# Altium schematic sheet 盟科大讯飞.schdoc
size B
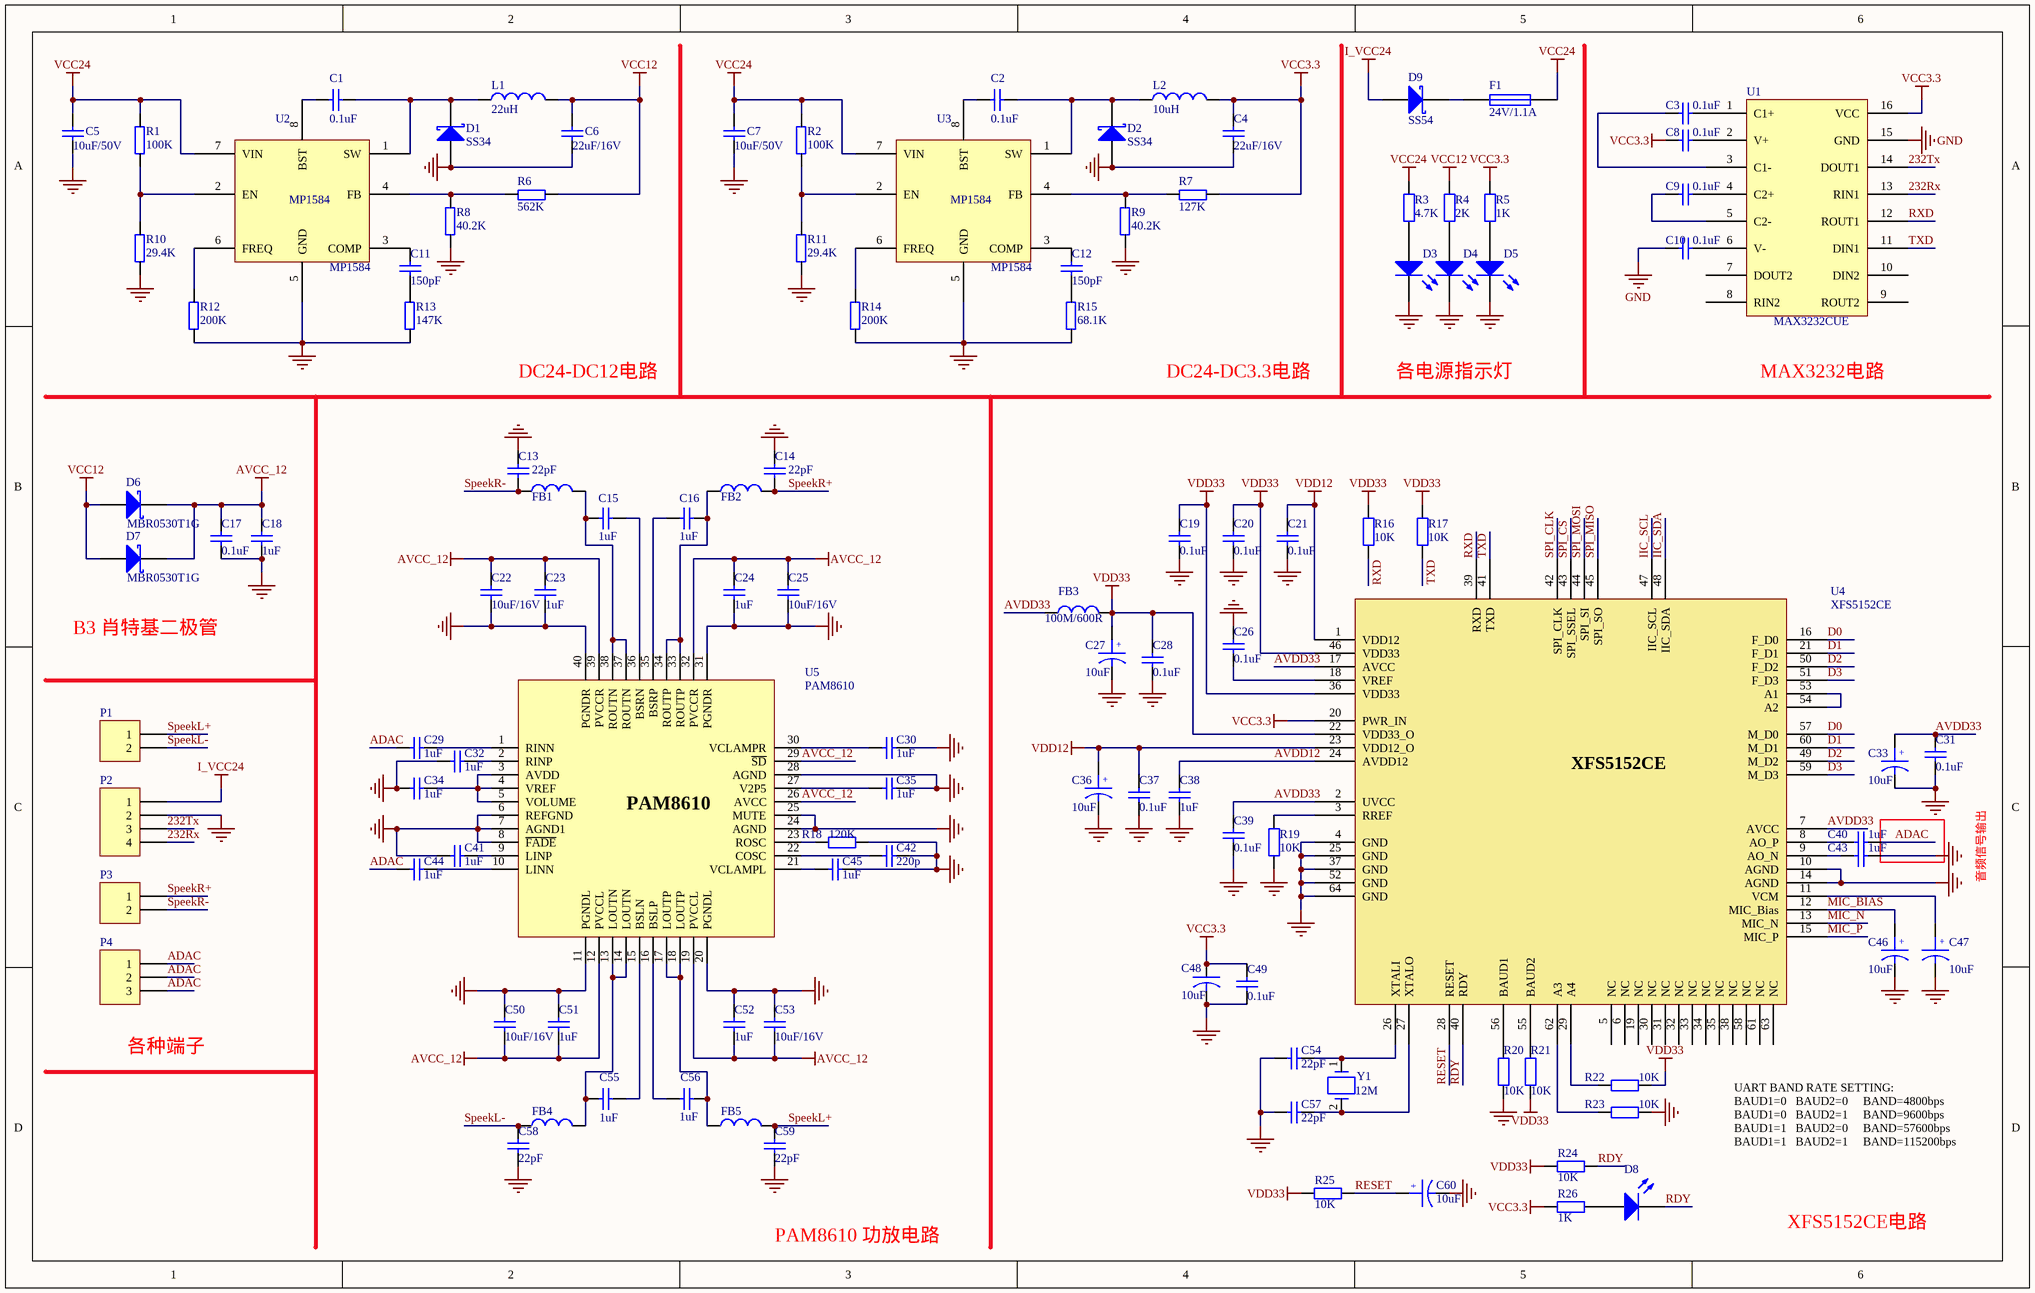
[diagram p0: 盟科大讯飞.schdoc]

## Parts
C1  0.1uF  [LC-0603_C]
C2  0.1uF  [LC-0603_C]
C3  0.1uF  [LC-0603_C]
C4  22uF/16V  [LC-1206_C]
C5  10uF/50V  [LC-1206_C]
C6  22uF/16V  [LC-1206_C]
C7  10uF/50V  [LC-1206_C]
C8  0.1uF  [LC-0603_C]
C9  0.1uF  [LC-0603_C]
C10  0.1uF  [LC-0603_C]
C11  150pF  [LC-0603_C]
C12  150pF  [LC-0603_C]
C13  22pF  [LC-0603_C]
C14  22pF  [LC-0603_C]
C15  1uF  [LC-0603_C]
C16  1uF  [LC-0603_C]
C17  0.1uF  [LC-0603_C]
C18  1uF  [LC-0603_C]
C19  0.1uF  [LC-0603_C]
C20  0.1uF  [LC-0603_C]
C21  0.1uF  [LC-0603_C]
C22  10uF/16V  [LC-1206_C]
C23  1uF  [LC-0603_C]
C24  1uF  [LC-0603_C]
C25  10uF/16V  [LC-1206_C]
C26  0.1uF  [LC-0603_C]
C27  10uF  [LC-CASE-A_3216]
C28  0.1uF  [LC-0603_C]
C29  1uF  [LC-0603_C]
C30  1uF  [LC-0603_C]
C31  0.1uF  [LC-0603_C]
C32  1uF  [LC-0603_C]
C33  10uF  [LC-CASE-A_3216]
C34  1uF  [LC-0603_C]
C35  1uF  [LC-0603_C]
C36  10uF  [LC-CASE-A_3216]
C37  0.1uF  [LC-0603_C]
C38  1uF  [LC-0603_C]
C39  0.1uF  [LC-0603_C]
C40  1uF  [LC-0603_C]
C41  1uF  [LC-0603_C]
C42  220p  [LC-0603_C]
C43  1uF  [LC-0603_C]
C44  1uF  [LC-0603_C]
C45  1uF  [LC-0603_C]
C46  10uF  [LC-CASE-A_3216]
C47  10uF  [LC-CASE-A_3216]
C48  10uF  [LC-CASE-A_3216]
C49  0.1uF  [LC-0603_C]
C50  10uF/16V  [LC-1206_C]
C51  1uF  [LC-0603_C]
C52  1uF  [LC-0603_C]
C53  10uF/16V  [LC-1206_C]
C54  22pF  [LC-0603_C]
C55  1uF  [LC-0603_C]
C56  1uF  [LC-0603_C]
C57  22pF  [LC-0603_C]
C58  22pF  [LC-0603_C]
C59  22pF  [LC-0603_C]
C60  10uF  [LC-CASE-A_3216]
D1  SS34  [SS34]
D2  SS34  [SS34]
D3  LED  [LC-0805_LED_S1]  (value not drawn)
D4  LED  [LC-0805_LED_S1]  (value not drawn)
D5  LED  [LC-0805_LED_S1]  (value not drawn)
D6  MBR0530T1G  [B3肖特基二极管]
D7  MBR0530T1G  [B3肖特基二极管]
D8  LED  [LC-0805_LED_S1]  (value not drawn)
D9  SS54  [DIOM6959X26N]
F1  24V/1.1A  [1206 F]
FB1  100M/600R  [LC-0805_L]  (value not drawn)
FB2  100M/600R  [LC-0805_L]  (value not drawn)
FB3  100M/600R  [LC-0805_L]
FB4  100M/600R  [LC-0805_L]  (value not drawn)
FB5  100M/600R  [LC-0805_L]  (value not drawn)
L1  22uH  [7*7*4mm电感]
L2  10uH  [7*7*4mm电感]
P1  (no value)  [DZ-2-3.5mm]
P2  (no value)  [DZ-4-3.5mm]
P3  (no value)  [DZ-2-3.5mm]
P4  (no value)  [单刀双掷贴片开关]
R1  100K  [LC-0603_R]
R2  100K  [LC-0603_R]
R3  4.7K  [LC-0603_R]
R4  2K  [LC-0603_R]
R5  1K  [LC-0603_R]
R6  562K  [LC-0603_R]
R7  127K  [LC-0603_R]
R8  40.2K  [LC-0603_R]
R9  40.2K  [LC-0603_R]
R10  29.4K  [LC-0603_R]
R11  29.4K  [LC-0603_R]
R12  200K  [LC-0603_R]
R13  147K  [LC-0603_R]
R14  200K  [LC-0603_R]
R15  68.1K  [LC-0603_R]
R16  10K  [LC-0603_R]
R17  10K  [LC-0603_R]
R18  120K  [LC-0603_R]
R19  10K  [LC-0603_R]
R20  10K  [LC-0603_R]
R21  10K  [LC-0603_R]
R22  10K  [LC-0603_R]
R23  10K  [LC-0603_R]
R24  10K  [LC-0603_R]
R25  10K  [LC-0603_R]
R26  1K  [LC-0603_R]
U1  MAX3232CUE  [LC-SOIC-16_150mil]
U2  MP1584  [LC-SOIC-8_EP_150mil]
U3  MP1584  [LC-SOIC-8_EP_150mil]
U4  XFS5152CE  [LQFP64 10*10]
U5  PAM8610  [QFN50P600X600X80-40N]
Y1  12M  [XTAL 晶振]

## Nets
AVCC_12: C17.1 C18.1 C22.1 C23.1 C24.1 C25.1 C50.1 C51.1 C52.1 C53.1 D6.1(K) D7.1(K) U5.12(PVCCL) U5.19(PVCCL) U5.26(AVCC) U5.29(~{SD}) U5.32(PVCCR) U5.39(PVCCR)
GND: C4.1 C5.2 C6.1 C7.2 C10.2 C13.1 C14.1 C17.2 C18.2 C19.2 C20.2 C21.2 C22.2 C23.2 C24.2 C25.2 C26.1 C27.2 C28.2 C30.2 C31.2 C32.1 C33.2 C34.1 C35.2 C36.2 C37.2 C38.1 C39.2 C41.1 C42.2 C43.1 C45.2 C46.2 C47.2 C48.2 C49.2 C50.2 C51.2 C52.2 C53.2 C54.1 C57.1 C58.1 C59.1 C60.2 D1.2(A) D2.2(A) D3.2(K) D4.2(K) D5.2(K) P2.2 R8.2 R9.2 R10.2 R11.2 R12.2 R13.2 R14.2 R15.2 R18.1 R19.1 R20.2 R23.1 U1.15(GND) U2.5(GND) U3.5(GND) U4.4(GND) U4.10(AGND) U4.14(AGND) U4.25(GND) U4.37(GND) U4.52(GND) U4.64(GND) U5.6(REFGND) U5.7(AGND1) U5.8(~{FADE}) U5.11(PGNDL) U5.20(PGNDL) U5.24(AGND) U5.25(MUTE) U5.28(AGND) U5.31(PGNDR) U5.40(PGNDR)
I_VCC24: D9.2(A) P2.1
VCC3.3: C4.2 C8.2 C48.1 C49.1 L2.2 R5.1 R7.2 R26.1 U1.16(VCC) U4.20(PWR_IN)
VCC12: C6.2 D6.2(A) D7.2(A) L1.2 R4.2 R6.2
VCC24: C5.1 C7.1 F1.2 R1.1 R2.1 R3.1 U2.7(VIN) U3.7(VIN)
VDD12: C21.1 C36.1 C37.1 U4.1(VDD12) U4.23(VDD12_O)
VDD33: C19.1 C20.1 C27.1 C28.1 FB3.2 R16.2 R17.1 R21.2 R22.2 R24.1 R25.1 U4.22(VDD33_O) U4.36(VDD33) U4.46(VDD33)
232Rx: P2.4 U1.13(RIN1)
232Tx: P2.3 U1.14(DOUT1)
ADAC: C29.1 C40.1 C44.1 P4.1 P4.2 P4.3
AVDD12: C38.2 U4.24(AVDD12)
AVDD33: C31.1 C33.1 C39.1 FB3.1 U4.2(UVCC) U4.7(AVCC) U4.17(AVCC)
D0: U4.16(F_D0) U4.57(M_D0)
D1: U4.21(F_D1) U4.60(M_D1)
D2: U4.49(M_D2) U4.50(F_D2)
D3: U4.51(F_D3) U4.59(M_D3)
IIC_SCL: U4.47(IIC_SCL)
IIC_SDA: U4.48(IIC_SDA)
MIC_BIAS: C46.1 U4.12(MIC_Bias)
MIC_N: U4.13(MIC_N)
MIC_P: U4.15(MIC_P)
RDY: D8.2(K) R24.2 U4.40(RDY)
RESET: C60.1 R25.2 U4.28(RESET)
RXD: R16.1 U1.12(ROUT1) U4.39(RXD)
SpeekL+: C59.2 FB5.2 P1.1
SpeekL-: C58.2 FB4.1 P1.2
SpeekR+: C14.2 FB2.2 P3.1
SpeekR-: C13.2 FB1.1 P3.2
SPI_CLK: U4.42(SPI_CLK)
SPI_CS: U4.43(SPI_SSEL)
SPI_MISO: U4.45(SPI_SO)
SPI_MOSI: U4.44(SPI_SI)
TXD: R17.2 U1.11(DIN1) U4.41(TXD)
NetC1_1: C1.1 D1.1(K) L1.1 U2.1(SW)
NetC1_2: C1.2 U2.8(BST)
NetC2_1: C2.1 D2.1(K) L2.1 U3.1(SW)
NetC2_2: C2.2 U3.8(BST)
NetC3_1: C3.1 U1.1(C1+)
NetC3_2: C3.2 U1.3(C1-)
NetC8_1: C8.1 U1.2(V+)
NetC9_1: C9.1 U1.4(C2+)
NetC9_2: C9.2 U1.5(C2-)
NetC10_1: C10.1 U1.6(V-)
NetC11_1: C11.1 R13.1
NetC11_2: C11.2 U2.3(COMP)
NetC12_1: C12.1 R15.1
NetC12_2: C12.2 U3.3(COMP)
NetC15_1: C15.1 FB1.2 U5.37(ROUTN) U5.38(ROUTN)
NetC15_2: C15.2 U5.36(BSRN)
NetC16_1: C16.1 U5.35(BSRP)
NetC16_2: C16.2 FB2.1 U5.33(ROUTP) U5.34(ROUTP)
NetC26_2: C26.2 U4.18(VREF)
NetC29_2: C29.2 U5.1(RINN)
NetC30_1: C30.1 U5.30(VCLAMPR)
NetC32_2: C32.2 U5.2(RINP)
NetC34_2: C34.2 U5.3(AVDD) U5.4(VREF) U5.5(VOLUME)
NetC35_1: C35.1 U5.27(V2P5)
NetC40_2: C40.2 U4.8(AO_P)
NetC41_2: C41.2 U5.9(LINP)
NetC42_1: C42.1 U5.22(COSC)
NetC43_2: C43.2 U4.9(AO_N)
NetC44_2: C44.2 U5.10(LINN)
NetC45_1: C45.1 U5.21(VCLAMPL)
NetC47_1: C47.1 U4.11(VCM)
NetC54_2: C54.2 U4.26(XTALI) Y1.1
NetC55_1: C55.1 U5.15(BSLN)
NetC55_2: C55.2 FB4.2 U5.13(LOUTN) U5.14(LOUTN)
NetC56_1: C56.1 U5.16(BSLP)
NetC56_2: C56.2 FB5.1 U5.17(LOUTP) U5.18(LOUTP)
NetC57_2: C57.2 U4.27(XTALO) Y1.2
NetD3_1: D3.1(A) R3.2
NetD4_1: D4.1(A) R4.1
NetD5_1: D5.1(A) R5.2
NetD8_1: D8.1(A) R26.2
NetD9_1: D9.1(K) F1.1
NetR1_2: R1.2 R10.1 U2.2(EN)
NetR2_2: R2.2 R11.1 U3.2(EN)
NetR6_1: R6.1 R8.1 U2.4(FB)
NetR7_1: R7.1 R9.1 U3.4(FB)
NetR12_1: R12.1 U2.6(FREQ)
NetR14_1: R14.1 U3.6(FREQ)
NetR18_2: R18.2 U5.23(ROSC)
NetR19_2: R19.2 U4.3(RREF)
NetR20_1: R20.1 U4.56(BAUD1)
NetR21_1: R21.1 U4.55(BAUD2)
NetR22_1: R22.1 U4.29(A4)
NetR23_2: R23.2 U4.62(A3)
NetU4_53: U4.53(A1) U4.54(A2)

Not connected (* = marked no-connect by the designer): U1 7(DOUT2) 8(RIN2) 9(ROUT2) 10(DIN2); U4 5(NC) 6(NC) 19(NC) 30(NC) 31(NC) 32(NC) 33(NC) 34(NC) 35(NC) 38(NC) 58(NC) 61(NC) 63(NC)

## Notes on the sheet
- DC24-DC12电路
- DC24-DC3.3电路
- 各电源指示灯
- MAX3232电路
- B3 肖特基二极管
- 音频信号输出
- (near P4) 各种端子
- UART BAND RATE SETTING:
  BAUD1=0   BAUD2=0     BAND=4800bps
  BAUD1=0   BAUD2=1     BAND=9600bps
  BAUD1=1   BAUD2=0     BAND=57600bps
  BAUD1=1   BAUD2=1     BAND=115200bps
- PAM8610 功放电路
- XFS5152CE电路
- (in symbol CAP POL) +

## Library data of the parts
C1-C3 C8-C10 C17 C19-C21 C26 C28 C31 C37 C39 C49 = Cap Semi: Capacitor (Semiconductor SIM Model); Value: 104; Published: 8-Jun-2000; LatestRevisionDate: 29-May-2009; LatestRevisionNote: IPC-7351 Footprint Added.; PackageReference: C1206; Publisher: Altium Limited; PackageDescription: Chip Capacitor
C4-C7 C11 C12 C14 = Cap Semi: Capacitor (Semiconductor SIM Model); Published: 8-Jun-2000; LatestRevisionDate: 29-May-2009; LatestRevisionNote: IPC-7351 Footprint Added.; PackageReference: C1206; Publisher: Altium Limited; PackageDescription: Chip Capacitor
  C4 C6: Value: 22uF/16V
  C5 C7: Value: 10uF/50V
  C11 C12: Value: 150pF
  C14: Value: 22pF
C13 C58 C59 = Cap Semi: Capacitor (Semiconductor SIM Model); Value: 22p; Published: 8-Jun-2000; LatestRevisionDate: 29-May-2009; LatestRevisionNote: IPC-7351 Footprint Added.; PackageReference: C1206; Publisher: Altium Limited; PackageDescription: Chip Capacitor
C15 C16 C18 C23 C24 C29 C30 C32 C34 C35 C38 C40-C45 C51 C52 C55 C56 = Cap Semi: Capacitor (Semiconductor SIM Model); Value: 105; Published: 8-Jun-2000; LatestRevisionDate: 29-May-2009; LatestRevisionNote: IPC-7351 Footprint Added.; PackageReference: C1206; Publisher: Altium Limited; PackageDescription: Chip Capacitor
C22 C25 C50 C53 C54 C57 = Cap NP: 电容; Published: 8-Jun-2000; LatestRevisionDate: 17-Jul-2002; LatestRevisionNote: Re-released for DXP Platform.; Publisher: Altium Limited
C27 C33 C36 C46 C47 C60 = CAP POL: Part package: 6032
C48 = CAPACITOR
D1 D2 D6 D7 D9 = Diode 18TQ045: Schottky Rectifier; Note: Terminal 2 is the TAB and is electrically connected to the cathode; Published: 8-Jun-2000; LatestRevisionDate: 17-Jul-2002; LatestRevisionNote: Re-released for DXP Platform.; DatasheetVersion: Dec-1997; PackageVersion: Feb-1998; PackageReference: TO-220AC; Publisher: Altium Limited; PackageDescription: TO, Thru-Hole, Vertical, Heatsink Mounted; 3 In-Line Leads (1 Absent); Pitch 2.54 mm; ComponentLink1Description: Manufacturer Link; ComponentLink1URL: http://www.irf.com/; ComponentLink2Description: Datasheet; ComponentLink2URL: http://www.irf.com/product-info/datasheets/data/18tq.pdf
D3-D5 D8 = LED0: Typical INFRARED GaAs LED; Published: 8-Jun-2000; LatestRevisionDate: 08-Jul-2005; LatestRevisionNote: Mech Layer 1 removed.; PackageReference: LED-0; Publisher: Altium Limited; PackageDescription: LED; 2 Leads
F1 = Fuse 1: Fuse; Published: 8-Jun-2000; LatestRevisionDate: 17-Jul-2002; LatestRevisionNote: Re-released for DXP Platform.; PackageReference: PIN-W2/E2.8; Publisher: Altium Limited; PackageDescription: Thru-Hole; 2 Leads
FB1-FB5 = Fbead: 磁珠; Code_IEC: 1005; Published: 8-Jun-2000; LatestRevisionDate: 17-Jul-2002; LatestRevisionNote: Re-released for DXP Platform.; PackageReference: 0402-A; Publisher: Altium Limited; Code_JEITA: 0402
L1 L2 = Inductor: Code_IEC: 1005; Published: 8-Jun-2000; LatestRevisionDate: 29-May-2009; LatestRevisionNote: IPC-7351 Footprint Added.; PackageReference: 0402-A; Publisher: Altium Limited; PackageDescription: Chip Inductor; Code_JEITA: 0402
  L1: Value: 22uH
  L2: Value: 10uH
P1 P3 = Header 2: Header, 2-Pin; LatestRevisionDate: 17-Jul-2002; LatestRevisionNote: Re-released for DXP Platform.; Publisher: Altium Limited
P2 = Header 4: Header, 4-Pin; LatestRevisionDate: 17-Jul-2002; LatestRevisionNote: Re-released for DXP Platform.; Publisher: Altium Limited
P4 = Header 3: Header, 3-Pin; LatestRevisionDate: 17-Jul-2002; LatestRevisionNote: Re-released for DXP Platform.; Publisher: Altium Limited
R1 R2 R6-R15 = R_2
R3-R5 R16-R26 = Res2: Resistor; Published: 8-Jun-2000; LatestRevisionDate: 17-Jul-2002; LatestRevisionNote: Re-released for DXP Platform.; Publisher: Altium Limited
  R3: PackageReference: AXIAL-0.4; Value: 4.7K
  R4: PackageReference: AXIAL-0.4; Value: 2K
  R5 R26: PackageReference: AXIAL-0.4; Value: 1K
  R19: PackageReference: AXIAL-0.4; Value: 10K
U2 U3 = MP1584EN
U4 = XFS5152-2
U5 = PAM8610功放芯片
Y1 = XTAL1: 晶振